# EAGLE design gesamtschaltung (EAGLE 9.6.2)
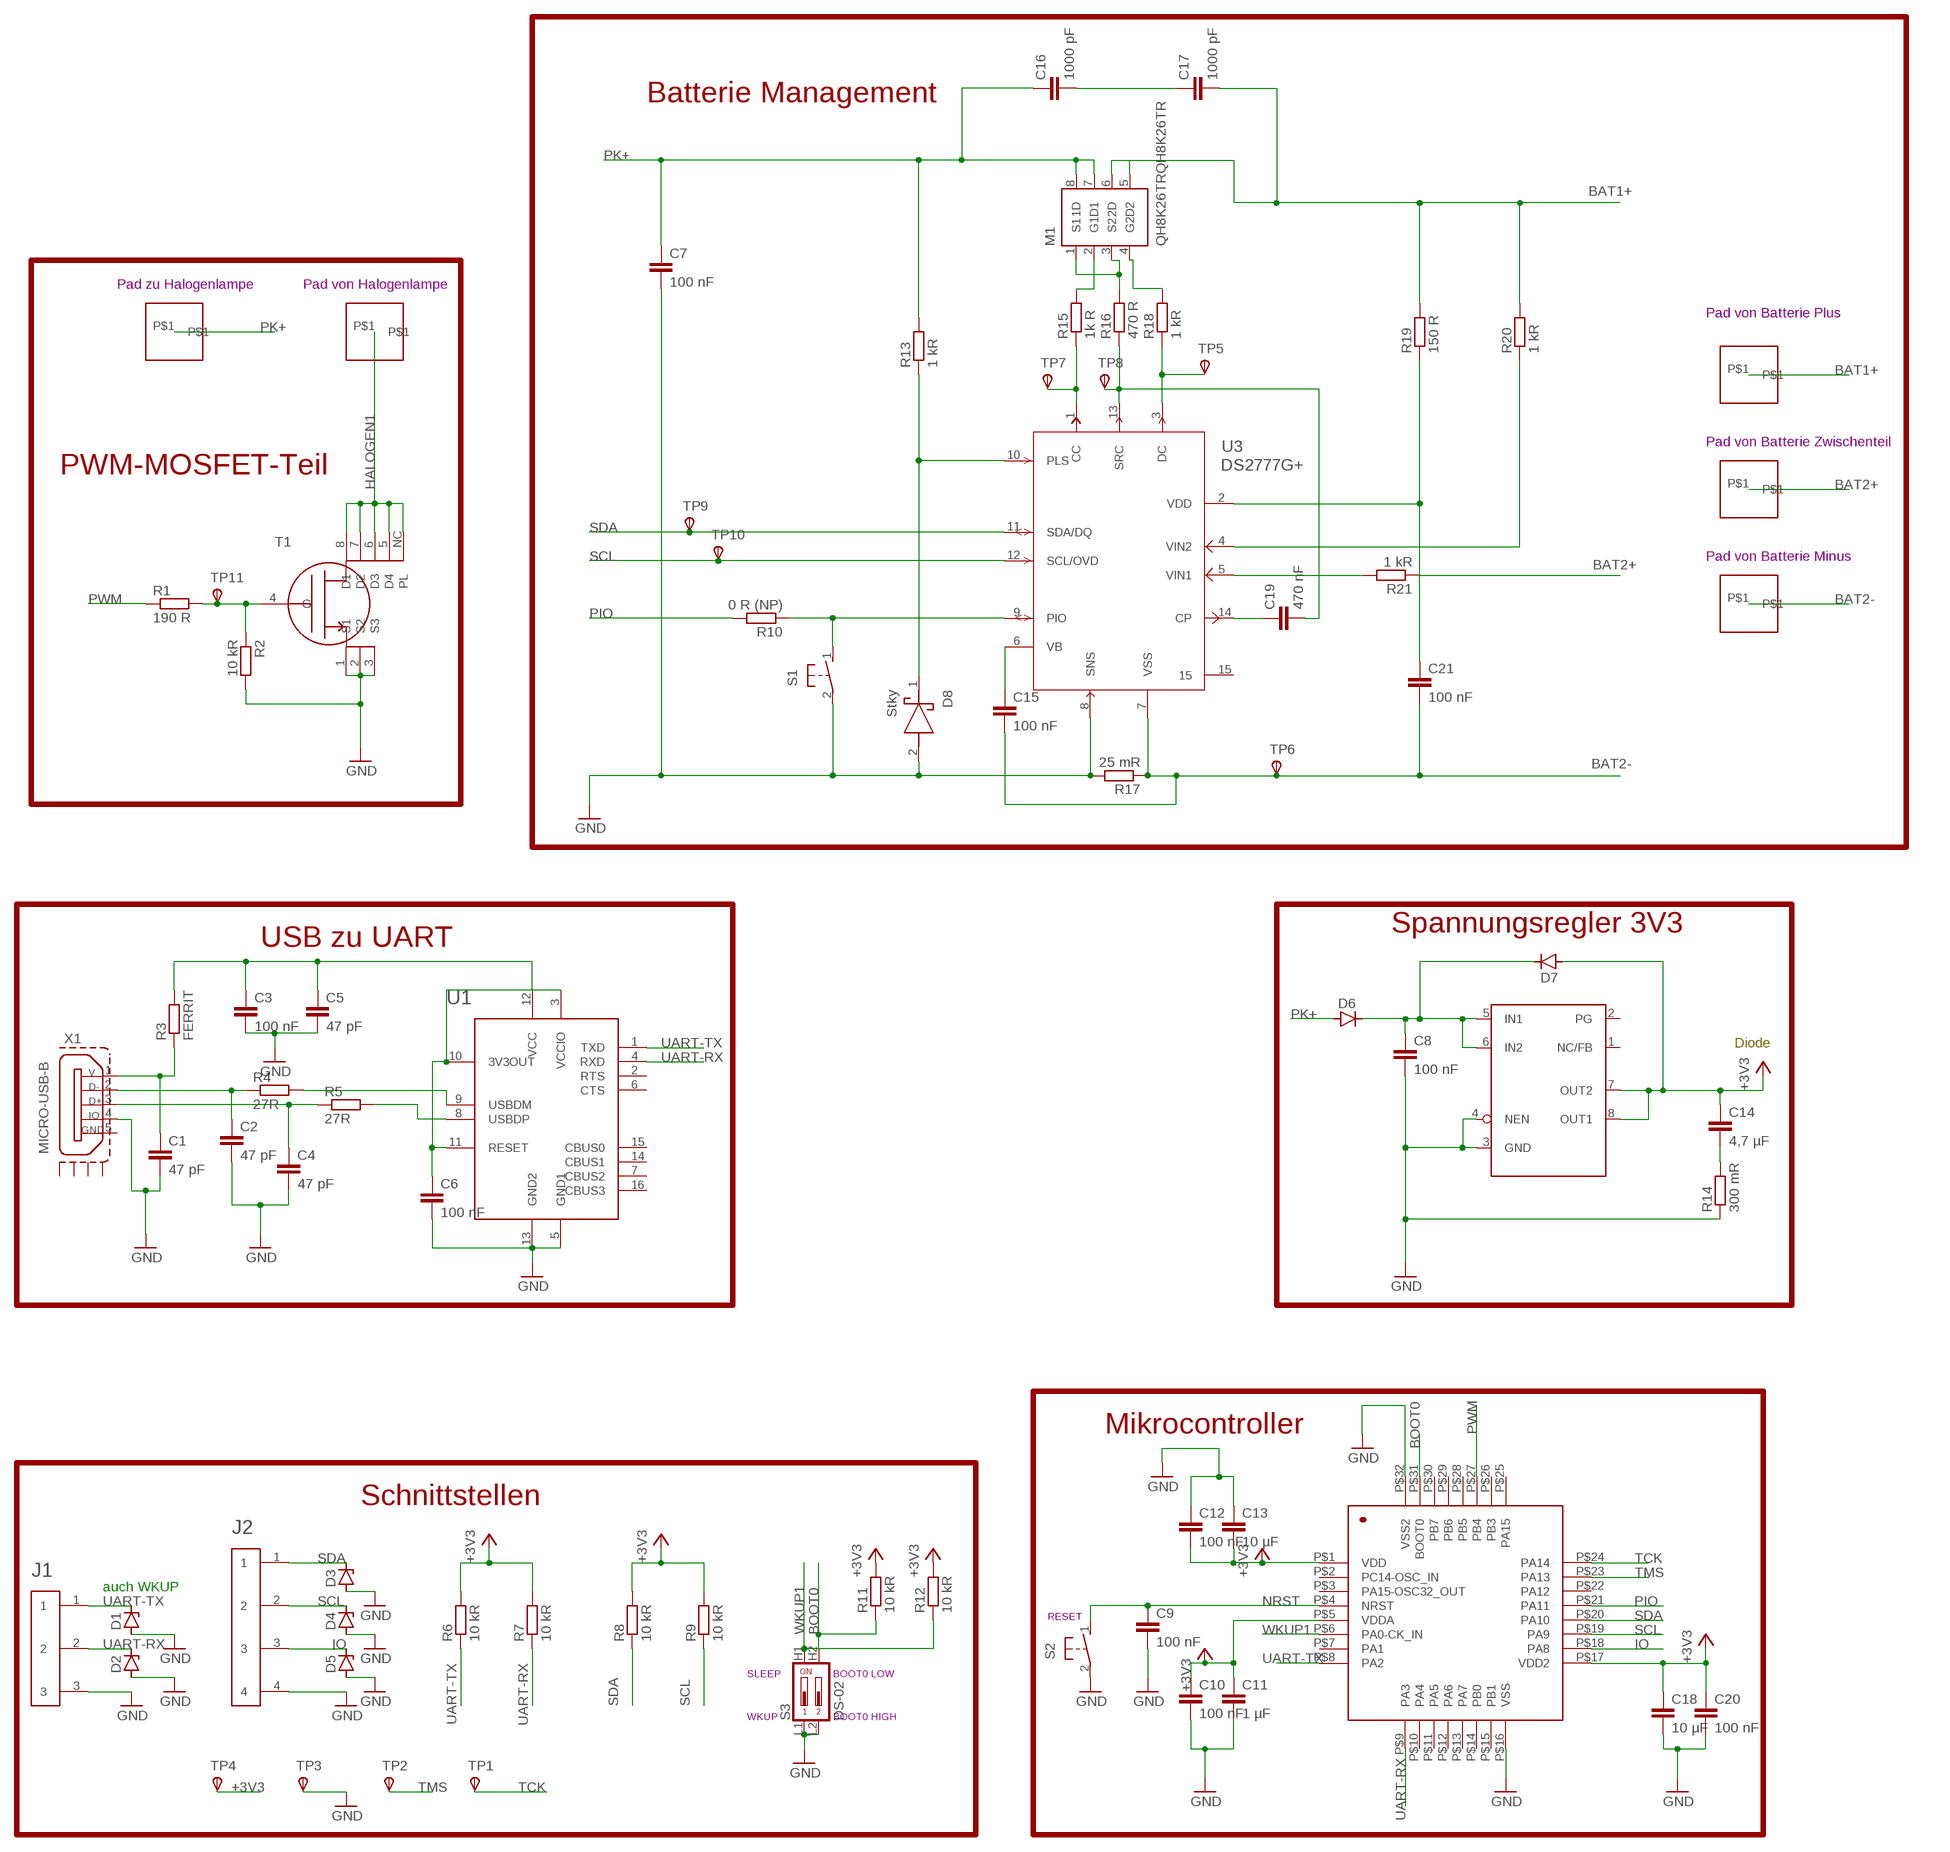
[diagram p0: schematic, sheet 1]

## Parts
C1  47 pF  C-EUC0603  [C0603]
C2  47 pF  C-EUC0603  [C0603]
C3  100 nF  C-EUC0603  [C0603]
C4  47 pF  C-EUC0603  [C0603]
C5  47 pF  C-EUC0603  [C0603]
C6  100 nF  C-EUC0603  [C0603]
C7  100 nF  C-EUC0603  [C0603]
C8  100 nF  C-EUC0603  [C0603]
C9  100 nF  C-EUC0603  [C0603]
C10  100 nF  C-EUC0603  [C0603]
C11  1 µF  C-EUC0603  [C0603]
C12  100 nF  C-EUC0603  [C0603]
C13  10 µF  C-EUC0603  [C0603]
C14  4,7 µF  C-EUC0603  [C0603]
C15  100 nF  C-EUC0603  [C0603]
C16  1000 pF  C-EUC0603  [C0603]
C17  1000 pF  C-EUC0603  [C0603]
C18  10 µF  C-EUC0603  [C0603]
C19  470 nF  C-EUC0603  [C0603]
C20  100 nF  C-EUC0603  [C0603]
C21  100 nF  C-EUC0603  [C0603]
D1  TVS-3V5  [TVS-FOOT]
D2  TVS-3V5  [TVS-FOOT]
D3  TVS-3V5  [TVS-FOOT]
D4  TVS-3V5  [TVS-FOOT]
D5  TVS-3V5  [TVS-FOOT]
D6  DIODE-SILIZIUM  [TVS-FOOT]
D7  DIODE-SILIZIUM  [TVS-FOOT]
D8  Stky  BAT54W-HG3-18SCHOTTKY  [SOD3715X135N]
J1  3PIN  [HDRV3W64P254_1X3_762X254X854B]
J2  4PIN-MALE  [4P-MALE-FOOT]
M1  QH8K26TRQH8K26TR  [SOTFL65P280X85-8N]
MC1  STM32L031K6T6  [LQFP32]
P1  PAD-3MM  [PAD-3MM]
P2  PAD-3MM  [PAD-3MM]
P3  PAD-3MM  [PAD-3MM]
P4  PAD-3MM  [PAD-3MM]
P5  PAD-3MM  [PAD-3MM]
R1  190 R  R-EU_R0603  [R0603]
R2  10 kR  R-EU_R0603  [R0603]
R3  FERRIT  R-EU_R0603  [R0603]
R4  27R  R-EU_R0603  [R0603]
R5  27R  R-EU_R0603  [R0603]
R6  10 kR  R-EU_R0603  [R0603]
R7  10 kR  R-EU_R0603  [R0603]
R8  10 kR  R-EU_R0603  [R0603]
R9  10 kR  R-EU_R0603  [R0603]
R10  0 R (NP)  R-EU_R0603  [R0603]
R11  10 kR  R-EU_R0603  [R0603]
R12  10 kR  R-EU_R0603  [R0603]
R13  1 kR  R-EU_R0603  [R0603]
R14  300 mR  R-EU_R0603  [R0603]
R15  1k R  R-EU_R0603  [R0603]
R16  470 R  R-EU_R0603  [R0603]
R17  25 mR  R-EU_R0603  [R0603]
R18  1 kR  R-EU_R0603  [R0603]
R19  150 R  R-EU_R0603  [R0603]
R20  1 kR  R-EU_R0603  [R0603]
R21  1 kR  R-EU_R0603  [R0603]
S1  BUTTON  [BUTTON]
S2  BUTTON  [BUTTON]
S3  DS-02  [DS-02]
T1  POWER-MOS  [SO-8]
TP1  TPSTP20R  [TP20R]
TP2  TPSTP20R  [TP20R]
TP3  TPSTP20R  [TP20R]
TP4  TPSTP20R  [TP20R]
TP5  TPSTP10R  [TP10R]
TP6  TPSTP10R  [TP10R]
TP7  TPSTP10R  [TP10R]
TP8  TPSTP10R  [TP10R]
TP9  TPSTP10R  [TP10R]
TP10  TPSTP10R  [TP10R]
TP11  TPSTP10R  [TP10R]
U1  FT230X  [SSOP16]
U2  TPS76633DR  [TPS766FOOTPRINT]
U3  DS2777G+  [DS2777_TDFN-15-OWN]
X1  MICRO-USB-B  [MICROUSBFOOT]

## Nets
+3V3: C10.1 C11.1 C12.2 C13.2 C14.1 C18.1 C20.1 D7.A MC1.P$1(VDD) MC1.P$5(VDDA) MC1.P$17(VDD2) R6.2 R7.2 R8.2 R9.2 R11.2 R12.2 TP4.TP(PP) U2.7(OUT2) U2.8(OUT1)
BAT1+: C17.2 M1.5(D2) M1.6(2D) P3.P$1 R19.2 R20.2
BAT2+: P4.P$1 R21.1
BAT2-: C15.2 C21.2 P5.P$1 R17.1 TP6.TP(PP) U3.7(VSS)
BOOT0: MC1.P$31(BOOT0) R11.1 S3.H2
GND: C1.2 C2.2 C3.2 C4.2 C5.2 C6.2 C7.2 C8.2 C9.2 C10.2 C11.2 C12.1 C13.1 C18.2 C20.2 D1.A D2.A D3.A D4.A D5.A D8.2(A) J1.3 J2.4 MC1.P$16(VSS) MC1.P$32(VSS2) R2.2 R14.1 R17.2 S1.2(L) S2.2(L) S3.L1 S3.L2 T1.1(S1) T1.2(S2) T1.3(S3) TP3.TP(PP) U1.5(GND1) U1.13(GND2) U2.3(GND) U2.4(NEN) U3.8(SNS) X1.4(IO)
HALOGEN1: P2.P$1 T1.5(D4) T1.6(D3) T1.7(D2) T1.8(D1) T1.NC(PL)
IO: D5.K J2.3 MC1.P$18(PA8)
N$1: R21.2 U3.5(VIN1)
N$2: R20.1 U3.4(VIN2)
N$3: C21.1 R19.1 U3.2(VDD)
N$4: C3.1 C5.1 R3.2 U1.12(VCC)
N$5: R1.2 R2.1 T1.4(G) TP11.TP(PP)
N$6: R4.2 U1.9(USBDM)
N$7: R15.1 TP7.TP(PP) U3.1(CC)
N$8: C19.2 R16.1 TP8.TP(PP) U3.13(SRC)
N$9: R18.1 TP5.TP(PP) U3.3(DC)
N$10: M1.2(G1) R15.2
N$11: M1.4(G2) R18.2
N$12: M1.1(S1) M1.3(S2) R16.2
N$13: C15.1 U3.6(VB)
N$14: C4.1 R5.1 X1.3(D+)
N$15: C16.2 C17.1
N$17: C19.1 U3.14(CP)
N$18: D8.1(K) R13.1 U3.10(PLS)
N$19: C8.1 D6.K D7.K U2.5(IN1) U2.6(IN2)
N$21: C2.1 R4.1 X1.2(D-)
N$22: C14.2 R14.2
N$23: R5.2 U1.8(USBDP)
N$24: C6.1 U1.3(VCCIO) U1.10(3V3OUT) U1.11(RESET)
N$25: C1.1 R3.1 X1.1(V)
NRST: C9.1 MC1.P$4(NRST) S2.1(H)
PIO: MC1.P$21(PA11) R10.2
PIO1: R10.1 S1.1(H) U3.9(PIO)
PK+: C7.1 C16.1 D6.A M1.7(D1) M1.8(1D) P1.P$1 R13.2
PWM: MC1.P$27(PB4) R1.1
SCL: D4.K J2.2 MC1.P$19(PA9) R9.1 TP10.TP(PP) U3.12(SCL/OVD)
SDA: D3.K J2.1 MC1.P$20(PA10) R8.1 TP9.TP(PP) U3.11(SDA/DQ)
TCK: MC1.P$24(PA14) TP1.TP(PP)
TMS: MC1.P$23(PA13) TP2.TP(PP)
UART-RX: D2.K J1.2 MC1.P$9(PA3) R7.1 U1.4(RXD)
UART-TX: D1.K J1.1 MC1.P$8(PA2) R6.1 U1.1(TXD)
WKUP1: MC1.P$6(PA0-CK_IN) R12.1 S3.H1
Unconnected: MC1.P$2(PC14-OSC_IN) MC1.P$3(PA15-OSC32_OUT) MC1.P$7(PA1) MC1.P$10(PA4) MC1.P$11(PA5) MC1.P$12(PA6) MC1.P$13(PA7) MC1.P$14(PB0) MC1.P$15(PB1) MC1.P$22(PA12) MC1.P$25(PA15) MC1.P$26(PB3) MC1.P$28(PB5) MC1.P$29(PB6) MC1.P$30(PB7) U1.2(RTS) U1.6(CTS) U1.7(CBUS2) U1.14(CBUS1) U1.15(CBUS0) U1.16(CBUS3) U2.1(NC/FB) U2.2(PG) U3.15 X1.5(GND) X1.S1 X1.S2 X1.S3 X1.S4

## Notes on the sheet
- Batterie Management
- Pad zu Halogenlampe | Pad von Halogenlampe
- Pad von Batterie Plus
- Pad von Batterie Zwischenteil
- PWM-MOSFET-Teil
- Pad von Batterie Minus
- Spannungsregler 3V3
- USB zu UART
- Diode
- Mikrocontroller
- Schnittstellen
- auch WKUP
- RESET
- SLEEP | BOOT0 LOW
- WKUP | BOOT0 HIGH

## Library data of the parts
C1-C21 = rcl:C-EU: CAPACITOR, European symbol; SPICEPREFIX: C
D1-D5 = SamacSys_Parts:TVS-3V5
D6 D7 = SamacSys_Parts:DIODE-SILIZIUM
D8 = SamacSys_Parts:BAT54W-HG3-18: Schottky Diodes & Rectifiers 30V Zener SKY DIODE SOD-123 Source: Datasheet <https://componentsearchengine.com/Datasheets/1/BAT54W-HG3-18.pdf>
J1 = SamacSys_Parts:3PIN
J2 = SamacSys_Parts:4PIN-MALE
M1 = SamacSys_Parts:QH8K26TR
MC1 = SamacSys_Parts:STM32L031K6T6
P1-P5 = SamacSys_Parts:PAD-3MM
R1-R21 = rcl:R-EU_: RESISTOR, European symbol; SPICEPREFIX: R
S1 S2 = SamacSys_Parts:BUTTON
S3 = SamacSys_Parts:DS-02
T1 = SamacSys_Parts:POWER-MOS
TP1-TP11 = testpad:TPS: TEST PIN
U1 = SamacSys_Parts:FT230X
U2 = SamacSys_Parts:TPS76633DR
U3 = SamacSys_Parts:DS2777G+
X1 = zx62d-b-5pa8-oshpark_10:MICRO-USB-B

## Board
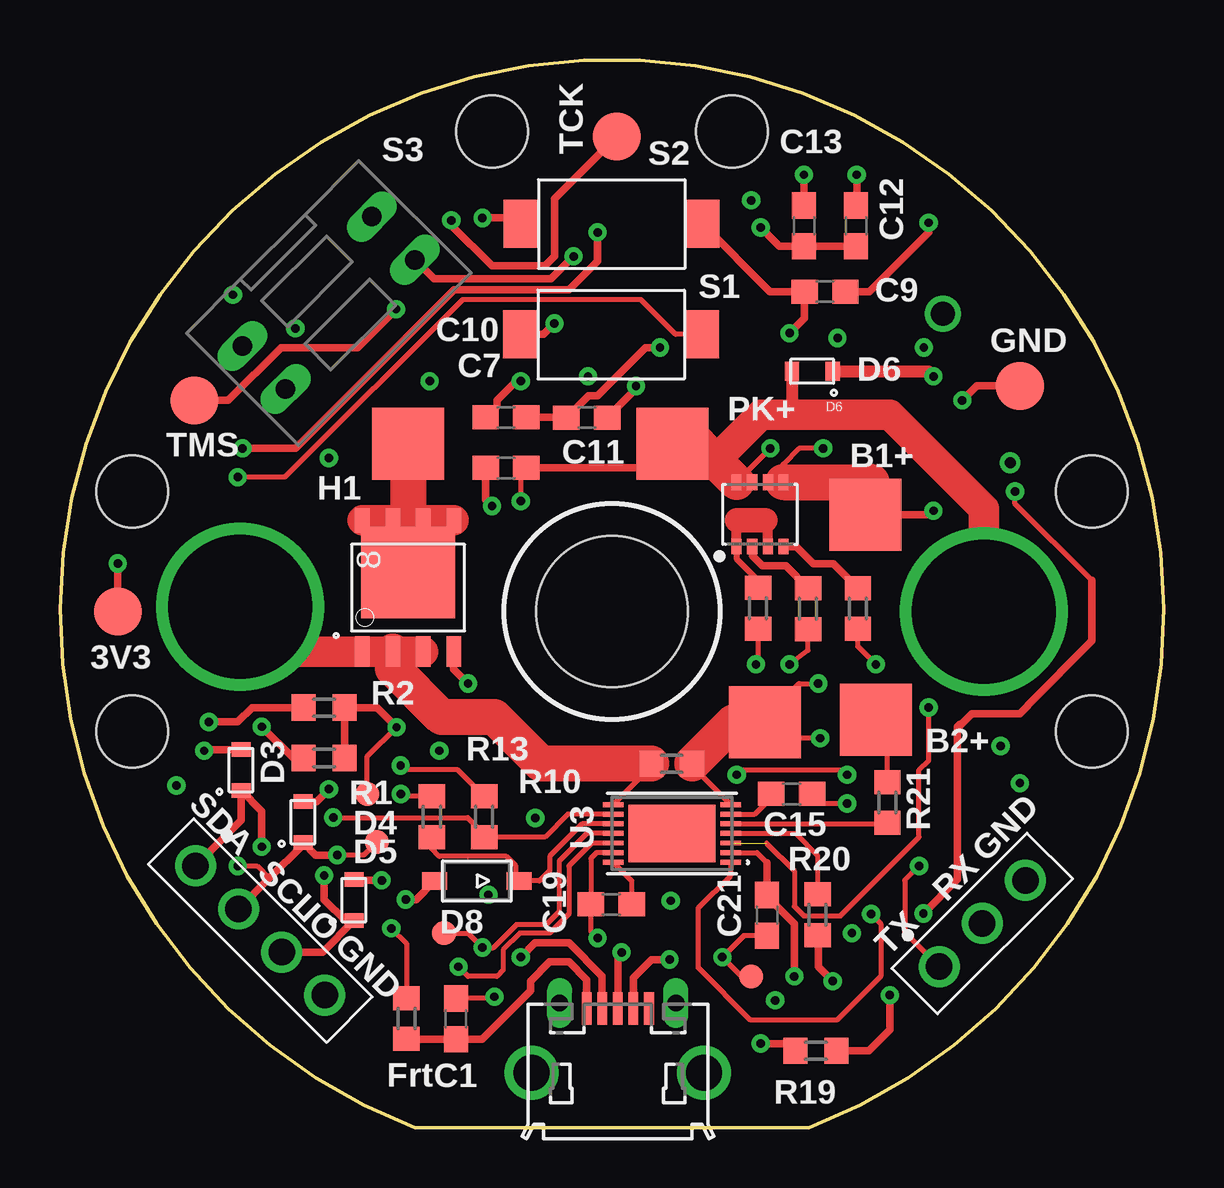
[diagram p1: board, top side]
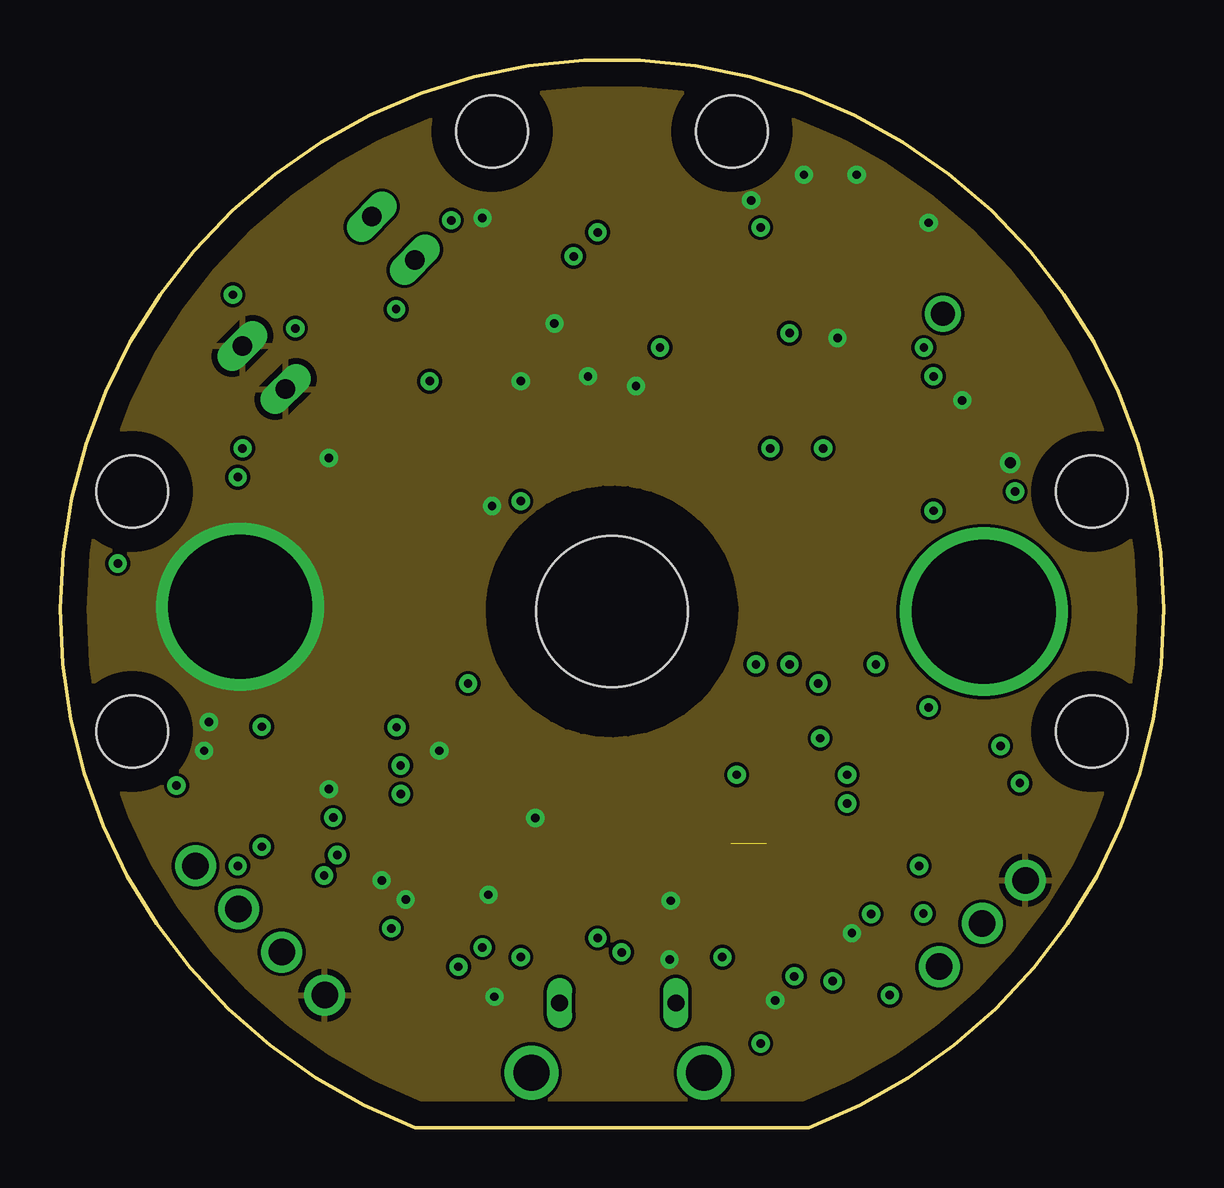
[diagram p2: board, inner layer Route2]
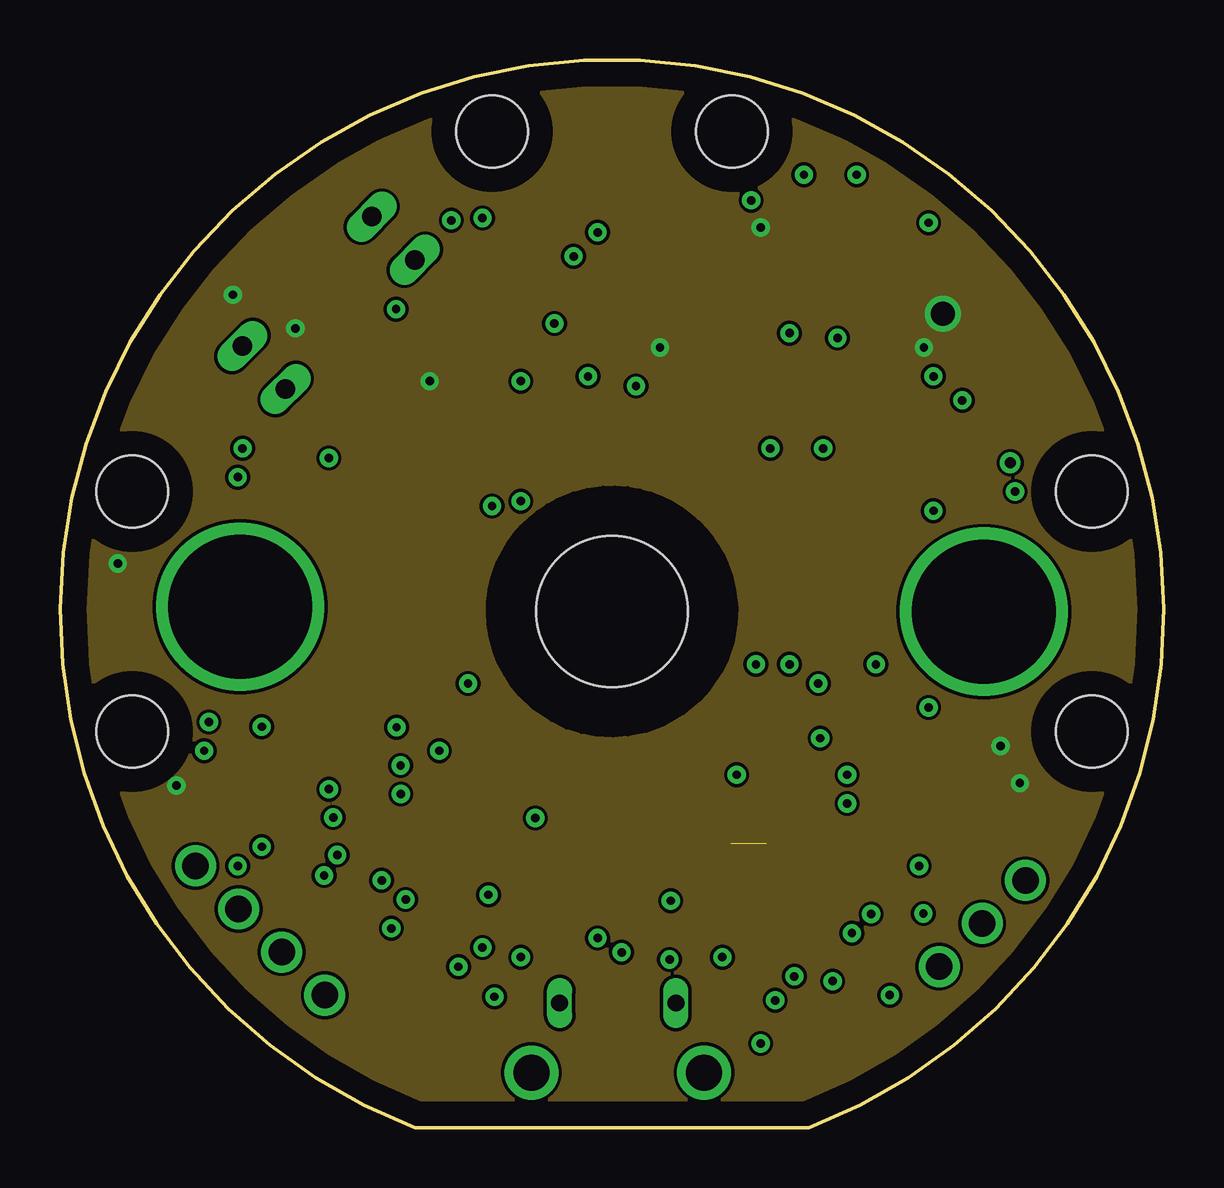
[diagram p3: board, inner layer Route15]
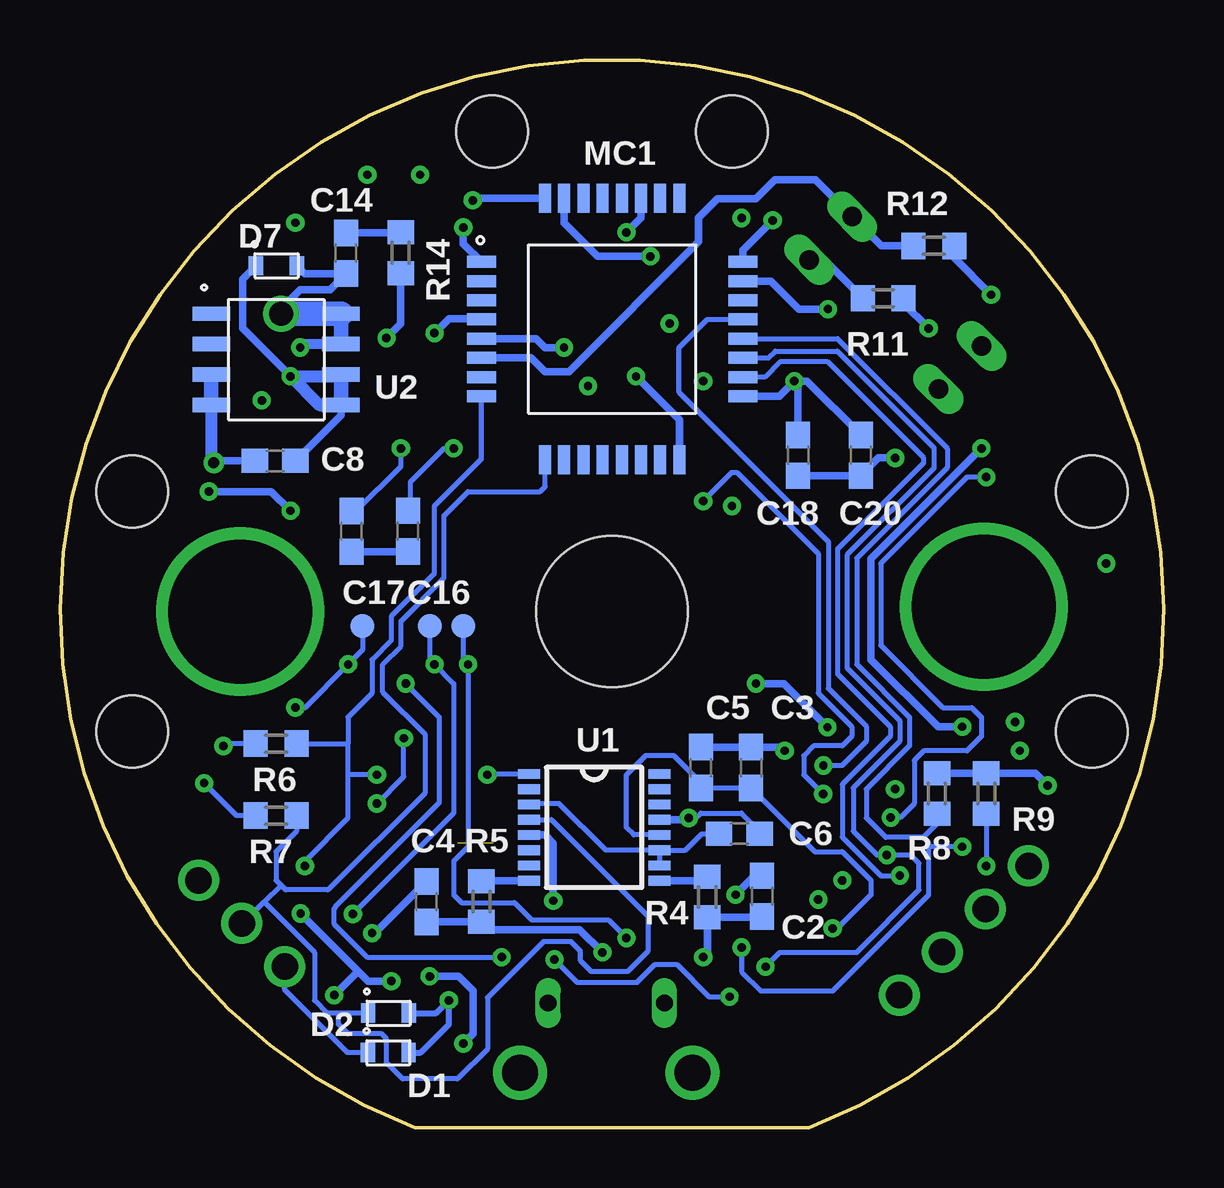
[diagram p4: board, bottom side, seen from below]

Size 46.02 x 44.48 mm. Coordinates in mm from the lower left corner, seen from the top.
Outline: 14.81,0 arc-318 31.21,0 14.81,0
Copper layers (1+2*15+16): Top 0.035mm / dielectric 0.2mm / Route2 0.035mm / dielectric 1.065mm / Route15 0.035mm / dielectric 0.2mm / Bottom 0.035mm
Design rules "default *": minimum track width 0.15mm, minimum drill 0.2mm, track to track 0.14mm, track to pad 5mil, pad to pad 5mil, via to via 10mil, smd to smd 5mil, copper to edge 40mil, drill to drill 0.5mm, minimum pad ring 0.15mm, minimum via ring 8mil, stop-mask expansion 4mil, vias tented up to drill 0mil, thermal gap 10mil
Holes 6.3 mm at 23.01,21.5
Holes 3 mm at 43.01,26.5 3.01,26.5 3.01,16.5 43.01,16.5 18.01,41.5 28.01,41.5

### Footprints (pad centres in the part's own frame; a part is rotated, then mirrored left to right if it is on the bottom)
C0603 = smd 1.1 x 1: 1 -0.85,0; 2 0.85,0
TVS-FOOT = smd 0.6 x 0.8: A 0.85,0; K -0.85,0
SOD3715X135N = smd 1.046 x 0.739: 1 -1.762,0; 2 1.762,0
HDRV3W64P254_1X3_762X254X854B = drill 1.105 pad 1.705: 1 0,0; 2 2.54,0; 3 5.08,0
4P-MALE-FOOT = drill 1.105 pad 1.705: 1 -2.54,0; 2 0,0; 3 2.54,0; 4 5.08,0
SOTFL65P280X85-8N = smd 0.65 x 0.42: 1 -1.34,0.975; 2 -1.34,0.325; 3 -1.34,-0.325; 4 -1.34,-0.975; 5 1.34,-0.975; 6 1.34,-0.325; 7 1.34,0.325; 8 1.34,0.975
LQFP32 = smd 1.2 x 0.5: P$1 -5.45,2.8; P$2 -5.45,2; P$3 -5.45,1.2; P$4 -5.45,0.4; P$5 -5.45,-0.4; P$6 -5.45,-1.2; P$7 -5.45,-2; P$8 -5.45,-2.8; P$17 5.45,-2.8; P$18 5.45,-2; P$19 5.45,-1.2; P$20 5.45,-0.4; P$21 5.45,0.4; P$22 5.45,1.2; P$23 5.45,2; P$24 5.45,2.8 | smd 0.5 x 1.2: P$9 -2.8,-5.45; P$10 -2,-5.45; P$11 -1.2,-5.45; P$12 -0.4,-5.45; P$13 0.4,-5.45; P$14 1.2,-5.45; P$15 2,-5.45; P$16 2.8,-5.45; P$25 2.8,5.45; P$26 2,5.45; P$27 1.2,5.45; P$28 0.4,5.45; P$29 -0.4,5.45; P$30 -1.2,5.45; P$31 -2,5.45; P$32 -2.8,5.45
PAD-3MM = smd 3 x 3: P$1 0,0
R0603 = smd 1 x 1.1: 1 -0.85,0; 2 0.85,0
BUTTON = smd 1.45 x 2: 1 3.775,0; 2 -3.775,0
DS-02 = drill 0.813 long: H1 -1.27,3.81; H2 1.27,3.81; L1 -1.27,-3.81; L2 1.27,-3.81
SO-8 = smd 1.27 x 0.61: 1 -2.67,1.905; 2 -2.67,0.635; 3 -2.67,-0.635; 4 -2.67,-1.905; 6 2.67,-0.635; 7 2.67,0.635 | smd 1.02 x 0.61: 5 2.795,-1.905; 8 2.795,1.905 | smd 3.81 x 3.91: NC 0.62,0
TP20R = smd 2 x 2: TP 0,0
TP10R = smd 1 x 1: TP 0,0
SSOP16 = smd 0.914 x 0.406: 1 -2.718,2.223; 2 -2.718,1.587; 3 -2.718,0.953; 4 -2.718,0.318; 5 -2.718,-0.318; 6 -2.718,-0.953; 7 -2.718,-1.587; 8 -2.718,-2.223; 9 2.718,-2.223; 10 2.718,-1.587; 11 2.718,-0.953; 12 2.718,-0.318; 13 2.718,0.318; 14 2.718,0.953; 15 2.718,1.587; 16 2.718,2.223
TPS766FOOTPRINT = smd 1.55 x 0.6: 1 -2.7,1.91; 2 -2.7,0.64; 3 -2.7,-0.63; 4 -2.7,-1.9; 5 2.7,-1.9; 6 2.7,-0.63; 7 2.7,0.64; 8 2.7,1.91
DS2777_TDFN-15-OWN = smd 0.85 x 0.204: 1 -2.55,1.2; 2 -2.55,0.8; 3 -2.55,0.4; 4 -2.55,0; 5 -2.55,-0.4; 6 -2.55,-0.8; 7 -2.55,-1.2; 8 2.35,-1.2; 9 2.35,-0.8; 10 2.35,-0.4; 11 2.35,0; 12 2.35,0.4; 13 2.35,0.8; 14 2.35,1.2 | smd 3.607 x 2.388: 15 -0.1,0
MICROUSBFOOT = smd 1.35 x 0.4: 1 4.825,1.3; 2 4.825,0.65; 3 4.825,0; 4 4.825,-0.65; 5 4.825,-1.3 | drill 1.5: S1 2.15,-3.6; S2 2.15,3.6 | drill 0.7 long: S3 5.05,2.425; S4 5.05,-2.425

### Placement (x,y rotation side)
C1  16.51,4.53 90 top
C2  16.75,9.64 90 bottom
C3  17.21,15 90 bottom
C4  30.74,9.41 90 bottom
C5  19.31,15 90 bottom
C6  17.7,12.24 0 bottom
C7  18.59,27.49 180 top
C8  37.05,27.78 180 bottom
C9  31.89,34.83 0 top
C10  18.59,29.59 180 top
C11  21.96,29.58 0 top
C12  33.18,37.57 270 top
C13  31.01,37.57 270 top
C14  34.09,36.43 90 bottom
C15  30.5,13.9 0 top
C16  31.52,24.85 270 bottom
C17  33.87,24.84 90 bottom
C18  15.26,28.01 270 bottom
C19  22.98,9.3 180 top
C20  12.64,28.01 270 bottom
C21  29.47,8.84 270 top
D1  32.34,3.13 0 bottom
D2  32.33,4.77 0 bottom
D3  7.55,14.9 90 top
D4  10.13,12.73 90 top
D5  12.26,9.48 90 top
D6  31.36,31.51 180 top
D7  37,35.91 0 bottom
D8  17.38,10.28 180 top
J1  36.65,6.71 45 top
J2  7.45,9.11 315 top
M1  29.18,25.55 90 top
MC1  23,33.27 0 bottom
P1  25.54,28.5 90 top
P2  14.51,28.5 90 top
P3  33.58,25.54 180 top
P4  34.01,17 0 top
P5  29.39,16.88 90 top
R1  11.01,15.4 0 top
R2  11.01,17.5 180 top
R3  14.44,4.54 90 top
R4  19.04,9.61 90 bottom
R5  28.45,9.42 90 bottom
R6  37.01,16 180 bottom
R7  37.01,13 180 bottom
R8  9.46,13.92 90 bottom
R9  7.41,13.92 90 bottom
R10  17.68,12.95 90 top
R11  11.71,34.56 0 bottom
R12  9.59,36.73 0 bottom
R13  15.5,12.95 90 top
R14  31.82,36.45 90 bottom
R15  31.18,21.62 90 top
R16  29.1,21.64 90 top
R17  25.5,15.16 180 top
R18  33.26,21.63 90 top
R19  31.51,3.2 0 top
R20  31.58,8.87 270 top
R21  34.49,13.54 270 top
S1  22.97,33.05 0 top
S2  23,37.65 0 top
S3  11.2,34.36 315 top
T1  14.51,22.5 90 top
TP1  23.21,41.3 0 top
TP2  5.61,30.3 0 top
TP3  40.01,30.9 0 top
TP4  2.41,21.5 0 top
TP5  33.41,20.9 0 bottom
TP6  28.81,6.3 0 top
TP7  30.61,20.9 0 bottom
TP8  29.21,20.9 0 bottom
TP9  16.01,8.1 0 top
TP10  13.21,11.9 0 top
TP11  12.81,13.9 0 top
U1  23.76,12.51 0 bottom
U2  37.01,32 0 bottom
U3  25.41,12.26 180 top
X1  23.25,0.14 90 top

### Tracks (layer width: path | path; a pad name or v marks a point on that pad's centre or on a via)
+3V3  (via drill 0.35, 1)
  Top 0.305: v29.21,37.5 29.99,36.72 C13.2 C12.2 | v25.01,32.5 24.41,32.5 22.41,30.5 22.03,30.5 C11.1 C10.1 | v2.41,23.5 TP4.TP
  Bottom 0.203: 37.81,15.55 37.81,16.3 37.86,16.25 R6.2 39.11,16 v39.21,15.9 | R7.2 38.66,13 v40.01,14.35
  Bottom 0.305: D7.A 35.82,35.58 C14.1 34.77,34.9 36.01,34.9 36.8,34.11 v36.8,33.91 | MC1.P$17 16.04,30.47 v15.41,31.1 | C18.1 15.26,30.95 v15.41,31.1 | C20.1 14.88,31.1 v15.41,31.1 | MC1.P$1 29.21,36.83 v29.21,37.5 | MC1.P$5 26.18,32.87 25.81,32.5 v25.01,32.5 | R12.2 8.74,36.23 v7.21,34.7 | R11.2 10.86,34.35 v9.81,33.3 | v4.86,14.25 5.37,14.77 R9.2 R8.2
  Bottom 0.406: U2.7 35.87,32.64 v36.01,32.5
  Bottom 0.61: U2.7 U2.8
  Bottom 1.016: U2.8 v36.8,33.91 v36.81,33.9
  pour Route15 (rank 2): 14.81,-1.5 33.61,-1.5 35.01,-0.1 46.21,11.1 46.21,12.7 46.21,33.3 43.41,36.1 34.61,44.9 15.81,44.9 12.61,44.9 -0.59,31.7 -0.79,31.5 -0.79,16.3 -0.79,11.3 11.81,-1.3 14.61,-1.3
BAT1+  (via drill 0.35)
  Top 0.203: 31.61,7.99 R20.2 | 38.01,17.25 37.96,17.25 37.51,16.8 | v31.81,28.3 30.81,28.3 30.16,27.64 M1.5 | v39.81,26.5 39.81,26 43.01,22.8
  Top 0.305: v36.41,25.7 36.25,25.54 P3.P$1 | 43.01,22.8 43.01,20.27 40.34,17.61 40.34,17.58 40.01,17.25 38.01,17.25 37.46,16.7 37.41,16.7 | 37.51,16.8 37.41,16.7 | 37.41,16.7 37.41,10.34 v35.99,8.92 | v32.21,6.1 31.61,6.7 31.61,7.99 | v34.59,5.52 34.59,4.08 33.71,3.2 R19.2
  Top 0.406: M1.6 M1.5
  Top 1.27: P3.P$1 33.58,26.64 33.83,26.89
  Top 1.5: M1.5 33.83,26.89
  Bottom 0.203: v32.21,6.1 33.21,6.1 33.61,6.5 35.99,8.88 v35.99,8.92 | C17.2 33.67,25.69 31.81,27.55 v31.81,28.3
  Bottom 0.305: v39.81,26.5 37.21,26.5 v36.41,25.7 | v35.99,8.92 33.17,6.1 v32.21,6.1 | v34.59,5.52 33.61,6.5
BAT2+
  Top 0.203: R21.1 34.49,16.52 P4.P$1
BAT2-  (via drill 0.35)
  Top 0.203: U3.7 26.35,15.07 R17.1 | v31.61,18.5 30.81,18.5 29.39,17.08 P5.P$1 30.05,16.22 v31.69,16.22 | C21.2 28.5,7.99 v27.61,7.1 28.41,6.3 TP6.TP | v32.81,13.5 31.75,13.5 C15.2
  Top 1.5: P5.P$1 28.07,16.88 R17.1
  Bottom 0.203: v31.61,18.5 30.21,17.1 30.21,13.54 34.54,9.2 34.54,9.17 34.61,9.1 34.61,8.5 33.21,7.1 v27.61,7.1 | v32.81,13.5 31.69,14.62 v31.69,16.22
BOOT0  (via drill 0.35)
  Top 0.305: S3.H2 15.59,35.36 20.47,35.36 v21.41,36.3
  Bottom 0.305: R11.1 14.16,36.16 S3.H2 | v21.41,36.3 23.61,36.3 25,37.69 MC1.P$31
GND  (via drill 0.35, 0.45, 6)
  Top 0.203: U3.8 24.65,15.05 R17.2 | v18.11,5.45 18.04,5.38 C1.2
  Top 0.305: C13.1 v31.01,39.7 | C12.1 33.21,38.45 v33.21,39.7 | C11.2 24.01,30.78 v24.01,30.9 | v19.21,31.1 19.01,31.1 18.21,30.3 18.21,30.06 C10.2 | S2.2 18.97,37.9 v17.61,37.9 | S1.2 20.16,33.05 v20.61,33.5 | D3.A 6.06,15.75 v6.01,15.7 | v6.21,16.9 7.41,16.9 8.01,17.5 R2.2 | v13.41,10.3 12.29,10.3 D5.A | D8.2 14.84,9.5 v14.41,9.5 | C1.2 16.58,5.45 | C7.2 17.74,26.17 v18.01,25.9 | D4.A 10.69,13.58 v11.21,14.1 | X1.4 23.9,6.24 24.66,7 v25.41,7 | C9.2 33.74,34.83 36.21,37.3 v36.21,37.7 | 39.41,30.3 TP3.TP 38.21,30.9 v37.61,30.3
  Top 1.27: T1.3 T1.2 T1.1 9.38,19.83 v7.51,21.7
  Top 1.5: R17.2 20.05,15.16 18.11,17.1 15.91,17.1 13.88,19.14 T1.2
  Bottom 0.203: v25.41,7 24.46,6.05 21.96,6.05 21.21,6.8 20.31,6.8 18.96,5.45 v18.11,5.45 | v19.81,12.9 19.51,12.9 19.31,13.1 17.61,13.1 16.85,12.34 C6.2
  Bottom 0.254: D1.A 30.98,3.13 29.81,4.3 v29.81,5.3 30.34,4.77 D2.A
  Bottom 0.305: U1.13 19.89,12.82 v19.81,12.9 | U1.5 25.81,12.19 25.46,11.84 v25.46,9.45 | C4.2 32.9,8.1 v33.01,8.1 | 39.71,27.8 v39.61,27.7 39.53,27.78 C8.2 | R14.1 31.82,33.49 v32.41,32.9 | MC1.P$32 28.72,38.72 v28.81,38.63 | MC1.P$16 20.2,29.49 v22.01,31.3 | v11.21,27.9 11.9,27.9 C20.2 C18.2 | v15.81,15.7 15.96,15.85 C3.2 C5.2 | C2.2 17.07,10.49 v17.86,9.7
  Bottom 0.508: U2.4 39.71,27.8
  Bottom 0.61: U2.3 U2.4
  pour Route2 (rank 2): 13.21,-2.1 33.21,-2.1 48.51,13.2 46.01,15.7 46.01,36.3 41.01,36.3 32.61,44.7 13.21,44.7 0.01,31.5 0.01,11.1
HALOGEN1
  Top 1.27: T1.6 15.27,25.3 T1.5 T1.8 13.75,25.3 T1.7 14.51,24.54 T1.NC
  Top 1.5: P2.P$1 T1.NC
IO  (via drill 0.35)
  Top 0.305: J2.3 10.94,7.31 D5.K 11.88,8.63 11.01,9.5 v11.01,10.5
  Bottom 0.203: MC1.P$18 16.64,31.27 16.01,31.9 14.01,31.9 10.01,27.9 10.01,27.7 13.61,24.1 13.61,18.9 11.41,16.7 11.41,16.3 13.41,14.3 13.41,12.1 11.81,10.5 v11.01,10.5
KEEPOUT1
  cutout Route2: 27.77,23.47 27.95,22.99 28.08,22.41 28.17,21.64 28.14,21.01 28.01,20.22 27.78,19.56 27.51,18.99 27.03,18.29 26.61,17.82 25.98,17.3 25.18,16.83 24.41,16.54 23.68,16.4 23.06,16.35 22.35,16.39 21.73,16.51 21.11,16.7 20.5,17.01 19.76,17.5 19.2,18.04 18.83,18.5 18.57,18.9 18.33,19.35 18.13,19.85 17.96,20.47 17.89,20.97 17.86,21.47 17.87,21.89 17.93,22.39 18.03,22.84 18.15,23.22 18.29,23.58 18.5,23.99 18.72,24.36 18.95,24.67 19.28,25.05 19.62,25.37 19.92,25.62 20.32,25.89 20.72,26.12 21.38,26.39 21.98,26.55 22.64,26.64 23.13,26.65 23.66,26.62 24.18,26.52 24.63,26.39 25.08,26.22 25.5,26.01 25.91,25.76 26.27,25.49 26.62,25.18 26.89,24.89 27.16,24.56 27.38,24.22 27.58,23.9
  cutout Route15: 27.77,23.47 27.95,22.99 28.08,22.41 28.17,21.64 28.14,21.01 28.01,20.22 27.78,19.56 27.51,18.99 27.03,18.29 26.61,17.82 25.98,17.3 25.18,16.83 24.41,16.54 23.68,16.4 23.06,16.35 22.35,16.39 21.73,16.51 21.11,16.7 20.5,17.01 19.76,17.5 19.2,18.04 18.83,18.5 18.57,18.9 18.33,19.35 18.13,19.85 17.96,20.47 17.89,20.97 17.86,21.47 17.87,21.89 17.93,22.39 18.03,22.84 18.15,23.22 18.29,23.58 18.5,23.99 18.72,24.36 18.95,24.67 19.28,25.05 19.62,25.37 19.92,25.62 20.32,25.89 20.72,26.12 21.38,26.39 21.98,26.55 22.64,26.64 23.13,26.65 23.66,26.62 24.18,26.52 24.63,26.39 25.08,26.22 25.5,26.01 25.91,25.76 26.27,25.49 26.62,25.18 26.89,24.89 27.16,24.56 27.38,24.22 27.58,23.9
N$1
  Top 0.203: U3.5 34.46,12.65 R21.2
N$2
  Top 0.203: U3.4 30.66,12.26 31.58,11.33 R20.1
N$3  (via drill 0.35)
  Top 0.203: U3.2 29.06,11.46 29.47,11.04 | C21.1 29.47,9.64
  Top 0.305: 29.47,11.04 C21.1 | v30.61,6.3 30.61,8.5 29.47,9.64 | v29.21,3.5 30.36,3.5 R19.1
  Bottom 0.305: v30.61,6.3 29.41,6.3 28.81,5.7 28.81,3.9 v29.21,3.5
N$4  (via drill 0.35)
  Top 0.203: v13.81,8.3 14.44,7.67 R3.2
  Bottom 0.203: U1.12 22.1,12.19 22.41,12.5 22.41,14.7 21.61,15.5 20.44,15.5 19.31,14.37 C5.1 C3.1 14.56,11.5 13.41,11.5 12.21,10.3 12.21,9.7 13.61,8.3 v13.81,8.3
N$5  (via drill 0.35)
  Top 0.203: TP11.TP 12.81,15.46 v14.03,16.68
  Top 0.305: R1.2 R2.1 13.21,17.5 v14.03,16.68 | v17.01,18.5 16.42,19.09 T1.4
  Bottom 0.305: v14.03,16.68 15.85,18.5 v17.01,18.5
N$6
  Bottom 0.203: 19.21,10.29 R4.2
  Bottom 0.305: U1.9 19.21,10.29
N$7  (via drill 0.35)
  Top 0.203: U3.1 27.96,10.5 26.61,9.15 26.61,6.65 28.76,4.5 32.41,4.5 34.21,6.3 34.21,8.5 v33.81,8.9 | v30.41,19.3 31.18,19.88 R15.1
  Bottom 0.203: v33.81,8.9 29.61,13.1 29.61,18.5 v30.41,19.3 30.61,19.5 TP7.TP
N$8  (via drill 0.35)
  Top 0.203: U3.13 22.37,11.46 22.13,11.22 C19.2 22.13,8.18 v22.41,7.9 | R16.1 29.1,19.39 v29.01,19.3
  Bottom 0.203: v22.41,7.9 23.16,8.65 26.36,8.65 27.08,9.37 29.28,9.37 29.61,9.7 29.61,11.1 29.01,11.7 v29.01,19.3 29.21,19.5 TP8.TP
N$9  (via drill 0.35)  (1 unrouted)
  Top 0.203: v36.21,17.5 36.21,15.3 35.81,14.9 35.81,12.1 32.53,8.82 31,8.82 30.61,9.21 30.61,10.7 29.46,11.86 | v34.01,19.3 33.26,20.05 R18.1
  Bottom 0.203: v36.21,17.5 35.81,17.5 v34.01,19.3 33.41,19.9 TP5.TP
N$10
  Top 0.305: M1.2 28.86,23.83 29.28,23.4 30.25,23.4 R15.2
N$11
  Top 0.305: M1.4 30.7,24.21 31.41,23.5 32.24,23.5 R18.2
N$12
  Top 0.254: M1.1 28.21,23.7 29.1,22.81
  Top 0.305: 29.1,22.81 R16.2
  Top 0.406: M1.3 29.51,25.2 29.41,25.3 | M1.1 28.21,25.3
  Top 0.61: 28.21,25.3
  Top 1.016: 28.21,25.3 29.41,25.3
N$13
  Top 0.203: U3.6 28.97,13.05 29.65,13.74 C15.1
N$14  (via drill 0.35)
  Top 0.305: X1.3 23.25,7.14 v23.41,7.3
  Bottom 0.305: v23.41,7.3 24.36,8.25 28.13,8.25 R5.1 29.01,8.57 C4.1
N$15
  Bottom 0.305: C17.1 C16.2
N$17
  Top 0.203: U3.14 23.83,10.29 C19.1
N$18
  Top 0.203: U3.10 21.77,12.65 20.41,11.3 20.41,10.7 19.99,10.28 D8.1 19.01,10.4 19.01,10.9 18.61,11.3 17.01,11.3 15.81,11.3 15.5,11.61 R13.1
N$19  (via drill 0.35)
  Top 0.305: 36.2,31.51 v36.41,31.3
  Top 0.508: D6.K 36.2,31.51
  Bottom 0.305: C8.1 34.31,29.67 U2.5 | 34.38,31.3 U2.6 | D7.K 38.41,35.35 38.41,33.3 v36.41,31.3
  Bottom 0.508: 34.38,31.3 v36.41,31.3 35.21,30.1 U2.5
  Bottom 0.61: U2.6 U2.5
N$21  (via drill 0.35)
  Top 0.305: X1.2 22.6,6.31 21.21,7.7 19.81,7.7 v19.21,7.1
  Bottom 0.305: v19.21,7.1 19.04,7.27 R4.1 16.78,8.76 C2.1
N$22
  Bottom 0.305: C14.2 31.84,37.28 R14.2
N$23
  Bottom 0.203: 28.43,10.29 R5.2
  Bottom 0.305: U1.8 28.43,10.29
N$24
  Bottom 0.203: U1.11 U1.10 | U1.11 23.27,11.56 25.21,13.5 26.43,13.5 U1.3 | U1.11 19.96,11.56 19.27,12.24 C6.1
N$25
  Top 0.305: R3.1 C1.1 17.59,3.68 19.61,5.7 19.61,6.1 20.41,6.9 21.21,6.9 21.95,6.16 X1.1
NRST  (via drill 0.35)
  Top 0.305: v30.41,33.1 31.04,33.73 C9.1 29.59,34.83 S2.1
  Bottom 0.305: v30.41,33.1 29.81,33.7 28.48,33.7 MC1.P$4
PIO  (via drill 0.35)
  Top 0.203: R10.2 16.58,14.9 14.38,14.9 v14.2,15.09
  Bottom 0.203: MC1.P$21 19.04,33.67 20.21,32.5 20.21,30.63 14,24.42 14,18.3 12.41,16.71 12.41,16.1 13.42,15.09 v14.2,15.09
PIO1  (via drill 0.35)
  Top 0.203: U3.9 21.17,13.05 20.21,12.1 17.81,12.1 | 17.81,12.1 R10.1 | S1.1 25.66,33.05 24.21,34.5 16.77,34.5 9.37,27.1 v7.41,27.1 | v11.39,12.92 16.99,12.92 17.81,12.1
  Bottom 0.203: v7.41,27.1 8.21,27.1 11.81,23.5 11.81,20.1 9.21,17.5 8.01,17.5 7.61,17.1 7.61,16.3 8.21,15.7 10.01,15.7 10.41,15.3 10.41,13.5 10.99,12.92 v11.39,12.92
PK+  (via drill 0.35, 6)
  Top 0.203: v14.21,13.9 14.31,13.8 R13.2 | v19.21,26.1 19.21,27.26 C7.1 | v29.61,28.3 28.41,27.1 28.41,26.89
  Top 0.305: C7.1 24.53,27.49 P1.P$1 | 30.51,29.8 30.61,29.7
  Top 0.406: M1.7 28.41,26.89 M1.8
  Top 0.508: D6.A 30.51,29.8
  Top 1.27: 26.6,28.5 P1.P$1 | 27.3,27.79 29.21,29.7 30.61,29.7 34.6,29.7 38.51,25.79 v38.51,21.5
  Top 1.5: M1.8 27.3,27.79 26.6,28.5
  Bottom 0.203: v14.21,13.9 15.01,14.7 15.01,15.5 14.61,15.9 13.41,15.9 13.01,16.3 13.01,16.7 14.41,18.1 14.41,23.9 17.81,27.3 18.01,27.3 v19.21,26.1 | C16.1 31.41,25.81 31.41,26.9 30.01,28.3 v29.61,28.3
PWM  (via drill 0.35)
  Top 0.305: v22.41,37.3 22.41,36.1 21.21,34.9 16.43,34.9 9.83,28.3 v7.61,28.3 | v8.41,16.7 9.71,15.4 R1.1
  Bottom 0.305: MC1.P$27 21.8,37.91 v22.41,37.3 | v7.61,28.3 12.21,23.7 12.21,19.5 9.41,16.7 v8.41,16.7
SCL  (via drill 0.35)
  Top 0.203: U3.12 22.17,11.86 21.21,10.9 21.21,8.9 20.41,8.1 19.64,8.1 19.17,8.1 18.48,7.4 18.48,6.57 18.21,6.3 17.01,6.3 v16.61,6.7 | v7.41,10.9 8.21,10.9 8.73,10.38 | TP10.TP 12.67,11.36 v11.56,11.36
  Top 0.305: J2.2 8.73,10.38 10.13,11.79 D4.K 10.66,11.36 v11.56,11.36
  Bottom 0.203: v16.61,6.7 16.01,7.3 12.81,7.3 10.21,9.9 10.21,11.01 10.56,11.36 v11.56,11.36 11.96,11.36 12.96,12.36 12.96,14.16 11.01,16.1 11.01,16.95 13.21,19.16 13.21,23.86 9.59,27.48 9.59,28.32 13.62,32.35 16.2,32.35 16.48,32.07 MC1.P$19 | R9.1 v7.41,10.9
SDA  (via drill 0.35)
  Top 0.203: U3.11 21.97,12.26 20.81,11.1 20.81,9 20.27,8.46 19.03,8.46 18.07,7.5 v17.61,7.5 17.01,8.1 TP9.TP
  Top 0.305: J2.1 7.55,12.8 D3.K 8.41,13.18 v8.41,11.7
  Bottom 0.203: v17.61,7.5 17.61,6.5 16.81,5.7 13.81,5.7 9.81,9.7 9.81,11.7 | MC1.P$20 13.61,32.87 9.04,28.3 9.04,27.5 12.81,23.73 12.81,19.3 10.61,17.1 10.61,15.9 12.41,14.1 12.41,12.9 11.6,12.09 10.02,12.09 | R8.1 9.46,12.65 10.02,12.09 | 10.02,12.09 9.81,11.88 9.81,11.7 | v8.41,11.7 9.81,11.7
TCK  (via drill 0.35)
  Top 0.305: v16.31,37.8 16.31,37.6 18.01,35.9 20.21,35.9 20.61,36.3 20.61,38.7 TP1.TP
  Bottom 0.305: MC1.P$24 17.55,36.56 v16.31,37.8
TMS  (via drill 0.35)
  Top 0.305: TP2.TP 7.01,30.3 9.21,32.5 12.41,32.5 v14.01,34.1
  Bottom 0.305: v14.01,34.1 15.21,34.1 16.38,35.27 MC1.P$23
UART-RX
  Bottom 0.203: J1.2 38.41,8.5 37.51,9.4 | 37.51,9.4 36.81,10.1 | MC1.P$9 25.8,26.71 26.01,26.5 29.01,26.5 30.01,25.5 30.01,22.9 31.81,21.1 31.81,20.06 32.57,19.3 32.57,18.14 30.81,16.38 30.81,13.94 34.85,9.9 36.61,9.9 36.81,10.1 | 37.51,9.4 35.41,7.3 35.41,5.3 34.88,4.77 34.41,4.77 | R7.1 36.16,12.35 37.01,11.5 37.01,10.3 36.81,10.1 | D2.K 34.41,4.77 | U1.4 25.54,12.82 21.51,8.8 21.51,7.35 22.36,6.5 23.86,6.5 24.34,6.97 24.34,7.37 24.72,7.75 25.87,7.75 28.21,5.42 28.21,3.27 29.45,2.02 31.73,2.02 32.41,2.7 32.41,3.7 32.61,3.9 34.01,3.9 34.41,4.3 34.41,4.77
UART-TX  (via drill 0.35)
  Top 0.203: J1.1 35.21,8.15 35.21,10.3 v35.81,10.9 | v28.21,14.7 28.41,14.9 32.61,14.9 v32.81,14.7
  Bottom 0.203: D1.K 34.04,3.13 36.65,5.74 J1.1 | v35.81,10.9 35.81,11.1 34.01,12.9 34.01,14.7 | 34.01,14.7 34.01,16 | MC1.P$8 28.45,27.86 30.41,25.9 30.41,23.1 32.21,21.3 32.21,20.3 33.01,19.5 33.01,18.1 34.01,17.1 34.01,16 | R6.1 34.01,16 | U1.1 28.18,14.73 v28.21,14.7 | v32.81,14.7 34.01,14.7
WKUP1
  Bottom 0.305: MC1.P$6 26.38,32.07 25.81,31.5 24.81,31.5 19.41,36.9 19.41,37.9 18.61,38.7 17.01,38.7 16.21,39.5 14.54,39.5 S3.H1 11.77,36.73 R12.1

### Text on the board
tPlace: C13 | S3 | TCK | S2 | C12 | S1 | C9 | C10 | GND | C7 | D6 | PK+ | TMS | C11 | B1+ | H1 | 3V3 | R2 | R13 | B2+ | D3 | SDA | R1 | R10 | D4 | C15 | R21 | D5 | U3 | GND | SCL | R20 | RX | IO | D8 | C19 | GND | C21 | TX | Frt | C1 | R19
bPlace: MC1 | C14 | R12 | D7 | R14 | R11 | U2 | C8 | C20 | C18 | C16 | C17 | C3 | C5 | U1 | R6 | R9 | R8 | C6 | R5 | C4 | R7 | R4 | C2 | D2 | D1
tDocu: - Kontakt | + Kontakt | Kabel / Halogen / Batterie